# EAGLE design E-P-015-R1.1 (EAGLE 7.5.0)
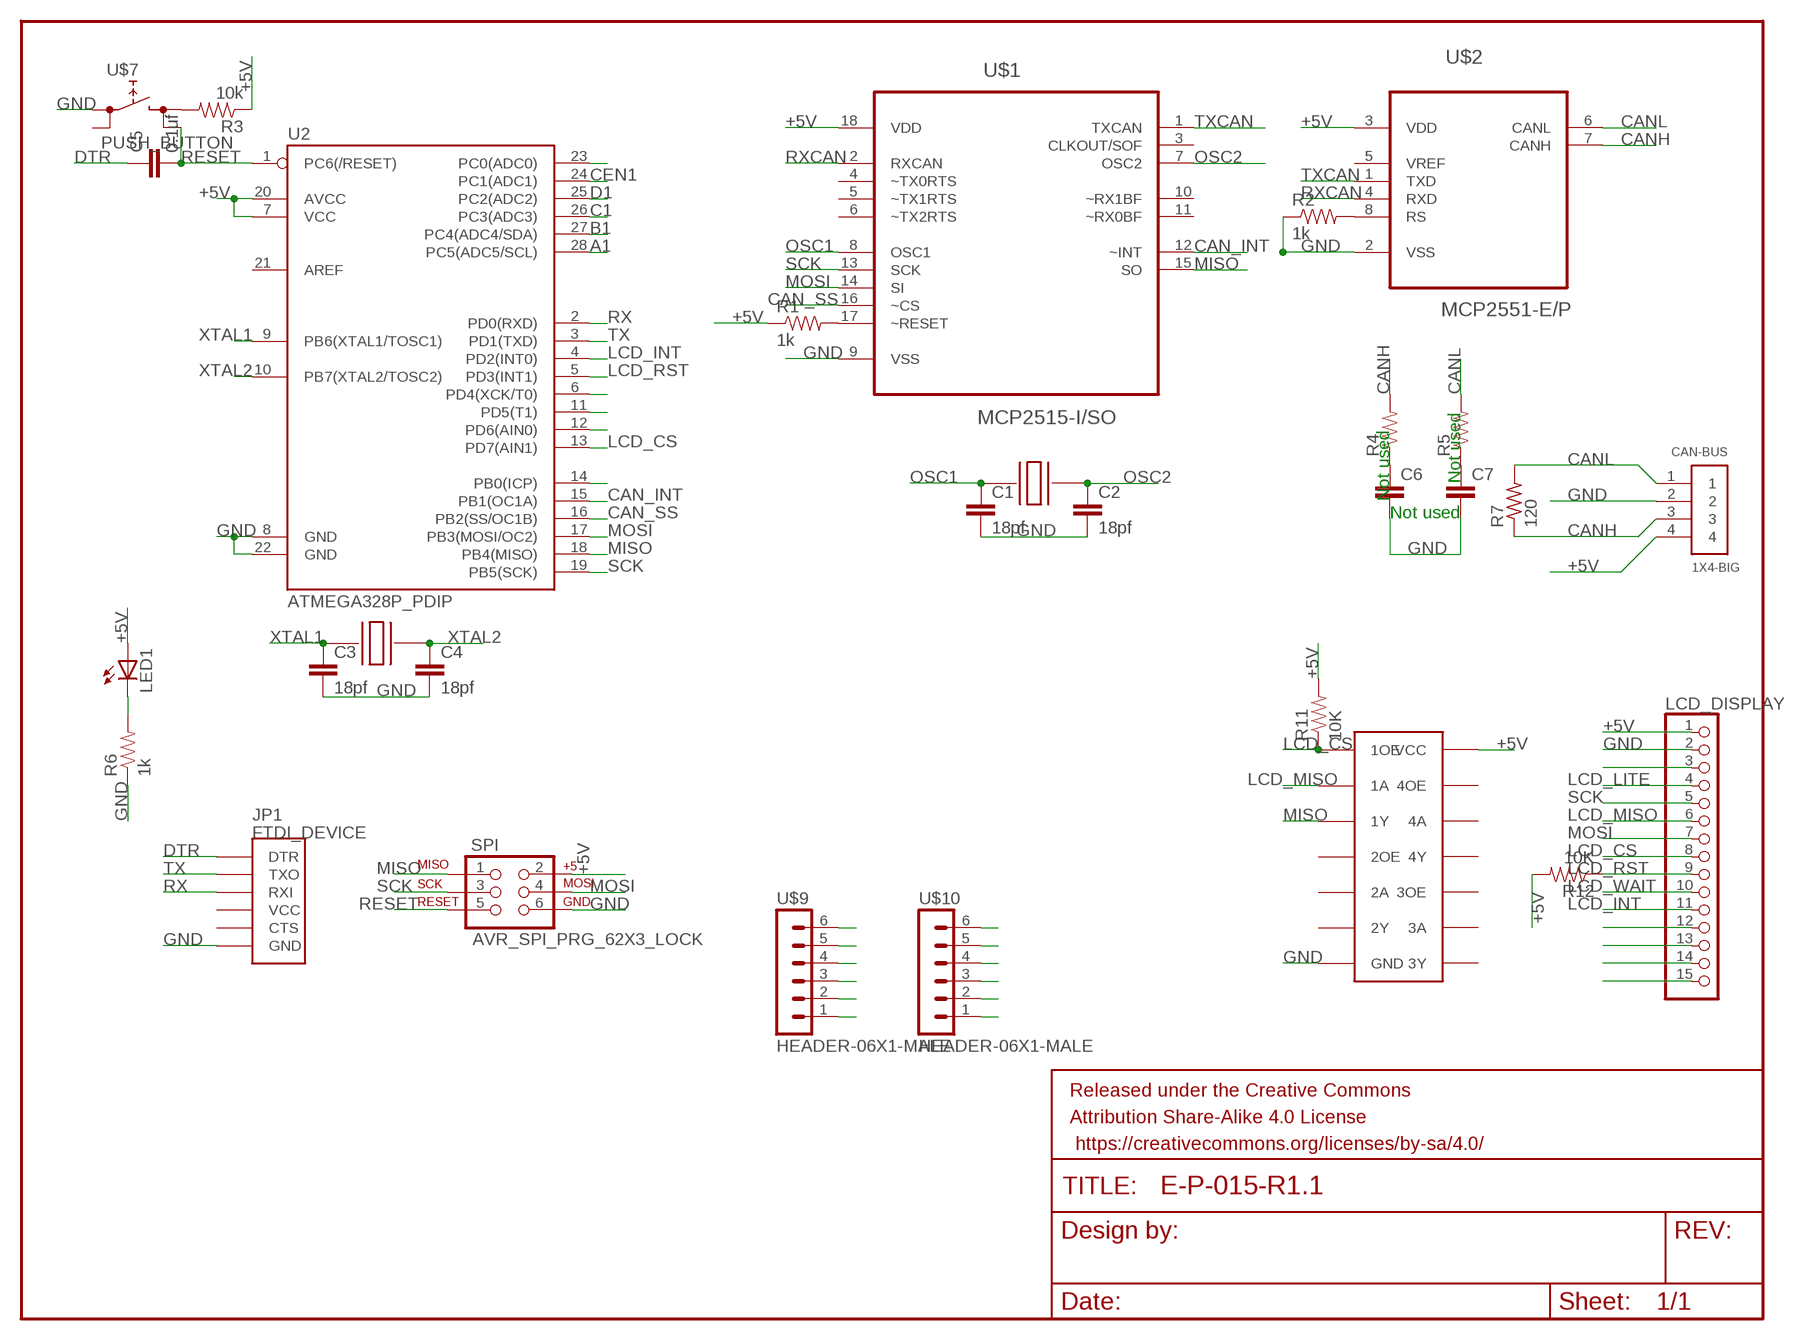
[diagram p0: schematic, sheet 1]

## Parts
C1  18pf  CAP0805  [0805]
C2  18pf  CAP0805  [0805]
C3  18pf  CAP0805  [0805]
C4  18pf  CAP0805  [0805]
C5  0.1uf  CAP0805  [0805]
C6  CAP0805  [0805]
C7  CAP0805  [0805]
CAN-BUS  1X4-BIG  [1X04-BIG]
FRAME1  FRAME-LETTERNO_PACKAGE  [DUMMY]
JP1  FTDI_DEVICE  [FTDI_DEVICE_SIDE]
LCD_DISPLAY  PINHD-1X15  [1X15]
LED1  LEDCHIPLED_1206  [CHIPLED_1206]
R1  1k  RESISTOR0805-RES  [0805]
R2  1k  RESISTOR0805-RES  [0805]
R3  10k  RESISTOR0805-RES  [0805]
R4  RESISTOR0805-RES  [0805]
R5  RESISTOR0805-RES  [0805]
R6  1k  RESISTOR0805-RES  [0805]
R7  120  R-US_M1206  [M1206]
R11  10K  RESISTOR0805-RES  [0805]
R12  10K  RESISTOR0805-RES  [0805]
SPI  AVR_SPI_PRG_62X3_LOCK  [2X3_LOCK]
U2  ATMEGA328P_PDIP  [DIL28-3]
U$1  MCP2515-I/SO  [SOIC127P1034X264-18N]
U$2  MCP2551-E/P  [DIP254P762X432-8]
U$3  CRYSTAL  [7A_CRYSTAL]
U$4  CRYSTAL  [7A_CRYSTAL]
U$5  SN74HC125N  [296-1572-5-ND]
U$7  PUSH_BUTTON  [PUSHBUTTON]
U$9  HEADER-06X1-MALE  [06X1-PTH]
U$10  HEADER-06X1-MALE  [06X1-PTH]

## Nets
+5V: CAN-BUS.4 LCD_DISPLAY.1 LED1.A R1.1 R3.1 R11.2 R12.2 SPI.2 U2.7(VCC) U2.20(AVCC) U$1.18(VDD) U$2.3(VDD) U$5.P$14(VCC)
A1: U2.28(PC5(ADC5/SCL)) U$9.6
A2: U2.23(PC0(ADC0)) U$10.6
B1: U2.27(PC4(ADC4/SDA)) U$9.5
B2: U2.6(PD4(XCK/T0)) U$10.5
C1: U2.26(PC3(ADC3)) U$9.4
C2: U2.11(PD5(T1)) U$10.4
CAN_INT: U2.15(PB1(OC1A)) U$1.12(~INT)
CAN_SS: U2.16(PB2(SS/OC1B)) U$1.16(~CS)
CANH: CAN-BUS.3 R4.2 R7.1 U$2.7(CANH)
CANL: CAN-BUS.1 R5.2 R7.2 U$2.6(CANL)
CEN1: U2.24(PC1(ADC1)) U$9.2
CEN2: U2.14(PB0(ICP)) U$10.2
D1: U2.25(PC2(ADC2)) U$9.3
D2: U2.12(PD6(AIN0)) U$10.3
DTR: C5.1 JP1.P$1(DTR)
GND: C1.2 C2.2 C3.2 C4.2 C6.2 C7.2 CAN-BUS.2 JP1.P$6(GND) LCD_DISPLAY.2 R2.1 R6.1 SPI.6 U2.8(GND) U2.22(GND) U$1.9(VSS) U$2.2(VSS) U$5.P$7(GND) U$7.L1(L) U$9.1 U$10.1
LCD_CS: LCD_DISPLAY.8 R11.1 U2.13(PD7(AIN1)) U$5.P$1(1OE)
LCD_INT: LCD_DISPLAY.11 U2.4(PD2(INT0))
LCD_LITE: LCD_DISPLAY.4
LCD_MISO: LCD_DISPLAY.6 U$5.P$2(1A)
LCD_RST: LCD_DISPLAY.9 R12.1 U2.5(PD3(INT1))
LCD_WAIT: LCD_DISPLAY.10
MISO: SPI.1 U2.18(PB4(MISO)) U$1.15(SO) U$5.P$3(1Y)
MOSI: LCD_DISPLAY.7 SPI.4 U2.17(PB3(MOSI/OC2)) U$1.14(SI)
N$1: R1.2 U$1.17(~RESET)
N$2: R2.2 U$2.8(RS)
N$3: C6.1 R4.1
N$4: R3.2 U$7.R1(R)
N$5: C7.1 R5.1
N$8: LED1.C R6.2
N$9: LCD_DISPLAY.3
N$20: LCD_DISPLAY.12
N$21: LCD_DISPLAY.13
N$22: LCD_DISPLAY.14
N$23: LCD_DISPLAY.15
OSC1: C1.1 U$1.8(OSC1) U$3.P$2
OSC2: C2.1 U$1.7(OSC2) U$3.P$1
RESET: C5.2 SPI.5 U2.1(PC6(/RESET)) U$7.R2(R)
RX: JP1.P$3(RXI) U2.2(PD0(RXD))
RXCAN: U$1.2(RXCAN) U$2.4(RXD)
SCK: LCD_DISPLAY.5 SPI.3 U2.19(PB5(SCK)) U$1.13(SCK)
TX: JP1.P$2(TXO) U2.3(PD1(TXD))
TXCAN: U$1.1(TXCAN) U$2.1(TXD)
XTAL1: C3.1 U2.9(PB6(XTAL1/TOSC1)) U$4.P$2
XTAL2: C4.1 U2.10(PB7(XTAL2/TOSC2)) U$4.P$1
Unconnected: JP1.P$4(VCC) JP1.P$5(CTS) U2.21(AREF) U$1.3(CLKOUT/SOF) U$1.4(~TX0RTS) U$1.5(~TX1RTS) U$1.6(~TX2RTS) U$1.10(~RX1BF) U$1.11(~RX0BF) U$2.5(VREF) U$5.P$4(2OE) U$5.P$5(2A) U$5.P$6(2Y) U$5.P$8(3Y) U$5.P$9(3A) U$5.P$10(3OE) U$5.P$11(4Y) U$5.P$12(4A) U$5.P$13(4OE) U$7.L2(L)

## Notes on the sheet
- Not used
- Not used
- Not used

## Library data of the parts
C1-C7 = SparkFun-Capacitors:CAP: Capacitor Standard 0603 ceramic capacitor, and 0.1" leaded capacitor.
CAN-BUS = adafruit:1X4: 4-pin connector
FRAME1 = SparkFun-Aesthetics:FRAME-LETTER: Schematic Frame Standard 8.5x11 US Letter frame; DESIGNER: Nobody; VERSION: v01
JP1 = SparkFun-Connectors:FTDI_DEVICE: Connector which mates to FTDI basic or FTDI cable.
LCD_DISPLAY = pinhead:PINHD-1X15: PIN HEADER
LED1 = E-P-099-R2.2:LED: LED OSRAM: - CHIPLED LG R971, LG N971, LY N971, LG Q971, LY Q971, LO R971, LY R971 LH N974, LH R974 LS Q976, LO Q976, LY Q976 LO Q996 - Hyper CHIPLED LW Q18S LB Q993, LB Q99A, LB R99A - SideLED LS A670, LO A670, LY A670, LG A670, LP A670 LB A673, LV A673, LT A673, LW A673 LH A674 LY A675 LS A676, LA A676, LO A676, LY A676, LW A676 LS A679, LY A679, LG A679 - Hyper Micro SIDELED® LS Y876, LA Y876, LO Y876, LY Y876 LT Y87S - SmartLED LW L88C, LW L88S LB L89C, LB L89S, LG L890 LS L89K, LO L89K, LY L89K LS L896, LA L896, LO L896, LY L896 - TOPLED LS T670, LO T670, LY T670, LG T670, LP T670 LSG T670, LSP T670, LSY T670, LOP T670, LYG T670 LG T671, LOG T671, LSG T671 LB T673, LV T673, LT T673, LW T673 LH T674 LS T676, LA T676, LO T676, LY T676, LB T676, LH T676, LSB T676, LW T676 LB T67C, LV T67C, LT T67C, LS T67K, LO T67K, LY T67K, LW E67C LS E67B, LA E67B, LO E67B, LY E67B, LB E67C, LV E67C, LT E67C LW T67C LS T679, LY T679, LG T679 LS T770, LO T770, LY T770, LG T770, LP T770 LB T773, LV T773, LT T773, LW T773 LH T774 LS E675, LA E675, LY E675, LS T675 LS T776, LA T776, LO T776, LY T776, LB T776 LHGB T686 LT T68C, LB T68C - Hyper Mini TOPLED® LB M676 - Mini TOPLED Santana® LG M470 LS M47K, LO M47K, LY M47K Source: http://www.osram.convergy.de LUXEON: - LUMILED® LXK2-PW12-R00, LXK2-PW12-S00, LXK2-PW14-U00, LXK2-PW14-V00 LXK2-PM12-R00, LXK2-PM12-S00, LXK2-PM14-U00 LXK2-PE12-Q00, LXK2-PE12-R00, LXK2-PE12-S00, LXK2-PE14-T00, LXK2-PE14-U00 LXK2-PB12-K00, LXK2-PB12-L00, LXK2-PB12-M00, LXK2-PB14-N00, LXK2-PB14-P00, LXK2-PB14-Q00 LXK2-PR12-L00, LXK2-PR12-M00, LXK2-PR14-Q00, LXK2-PR14-R00 LXK2-PD12-Q00, LXK2-PD12-R00, LXK2-PD12-S00 LXK2-PH12-R00, LXK2-PH12-S00 LXK2-PL12-P00, LXK2-PL12-Q00, LXK2-PL12-R00 Source: www.luxeon.com KINGBRIGHT: KA-3528ASYC Source: www.kingbright.com
R1-R6 = SparkFun-Passives:RESISTOR: Resistor Basic schematic elements and footprints for 0603, 1206, and PTH resistors.
R7 = adafruit:R-US_: RESISTOR, American symbol
R11 R12 = SparkFun-Resistors:RESISTOR: Resistor Basic schematic elements and footprints for 0603, 1206, and PTH resistors.
SPI = SparkFun-Connectors:AVR_SPI_PRG_6: AVR ISP 6 Pin This is the reduced ISP connector for AVR programming. Common on Arduino. This footprint will take up less PCB space and can be used with a 10-pin to 6-pin adapter such as SKU: BOB-08508 **Special note about "TEST_POINT" package. The stop mask is on the top side, so if you want your programming test points to be on the bottom of your board, make sure to place this package on the bottom side of the board. This also ensure that the orientation to program from the bottom side will be correct.
U2 = SparkFun-DigitalIC:ATMEGA328P_PDIP: uC used in the Arduino 32kb flash, 1k EEPROM, 2k SRAM This is the through-hole version of this chip.
U$1 = Microchip_By_element14_Batch_1:MCP2515-I/SO: CAN Controller; MPN: MCP2515-I/SO; OC_FARNELL: 1292239; OC_NEWARK: 29H7136; PACKAGE: SOIC-18; SUPPLIER: Microchip
U$2 = Microchip_By_element14_Batch_1:MCP2551-E/P: High-Speed CAN Transceiver; MPN: MCP2551-E/P; OC_FARNELL: 1439745; OC_NEWARK: 69K7603; PACKAGE: DIP-8; SUPPLIER: Microchip
U$3 U$4 = mylibrary:CRYSTAL
U$5 = Shell2015:SN74HC125N
U$7 = E-P-099-R2.2:PUSH_BUTTON
U$9 U$10 = GeekAmmo:HEADER-06X1?: 6 x 0.1 inch Header 40x1 0.1inch Male Breakaway header can be used. - 4UCON 00834 <http://www.4uconnector.com/online/SearchPro.asp?FormName=ProSearch&FormAction=search&s_GroupNo=&s_keyword=00834> For female part, if possible use 6 x 1 without breaking.; OTHER: 4UCON 00834; URL: http://www.4uconnector.com/online/SearchPro.asp?FormName=ProSearch&FormAction=search&s_GroupNo=&s_keyword=00834

## Board
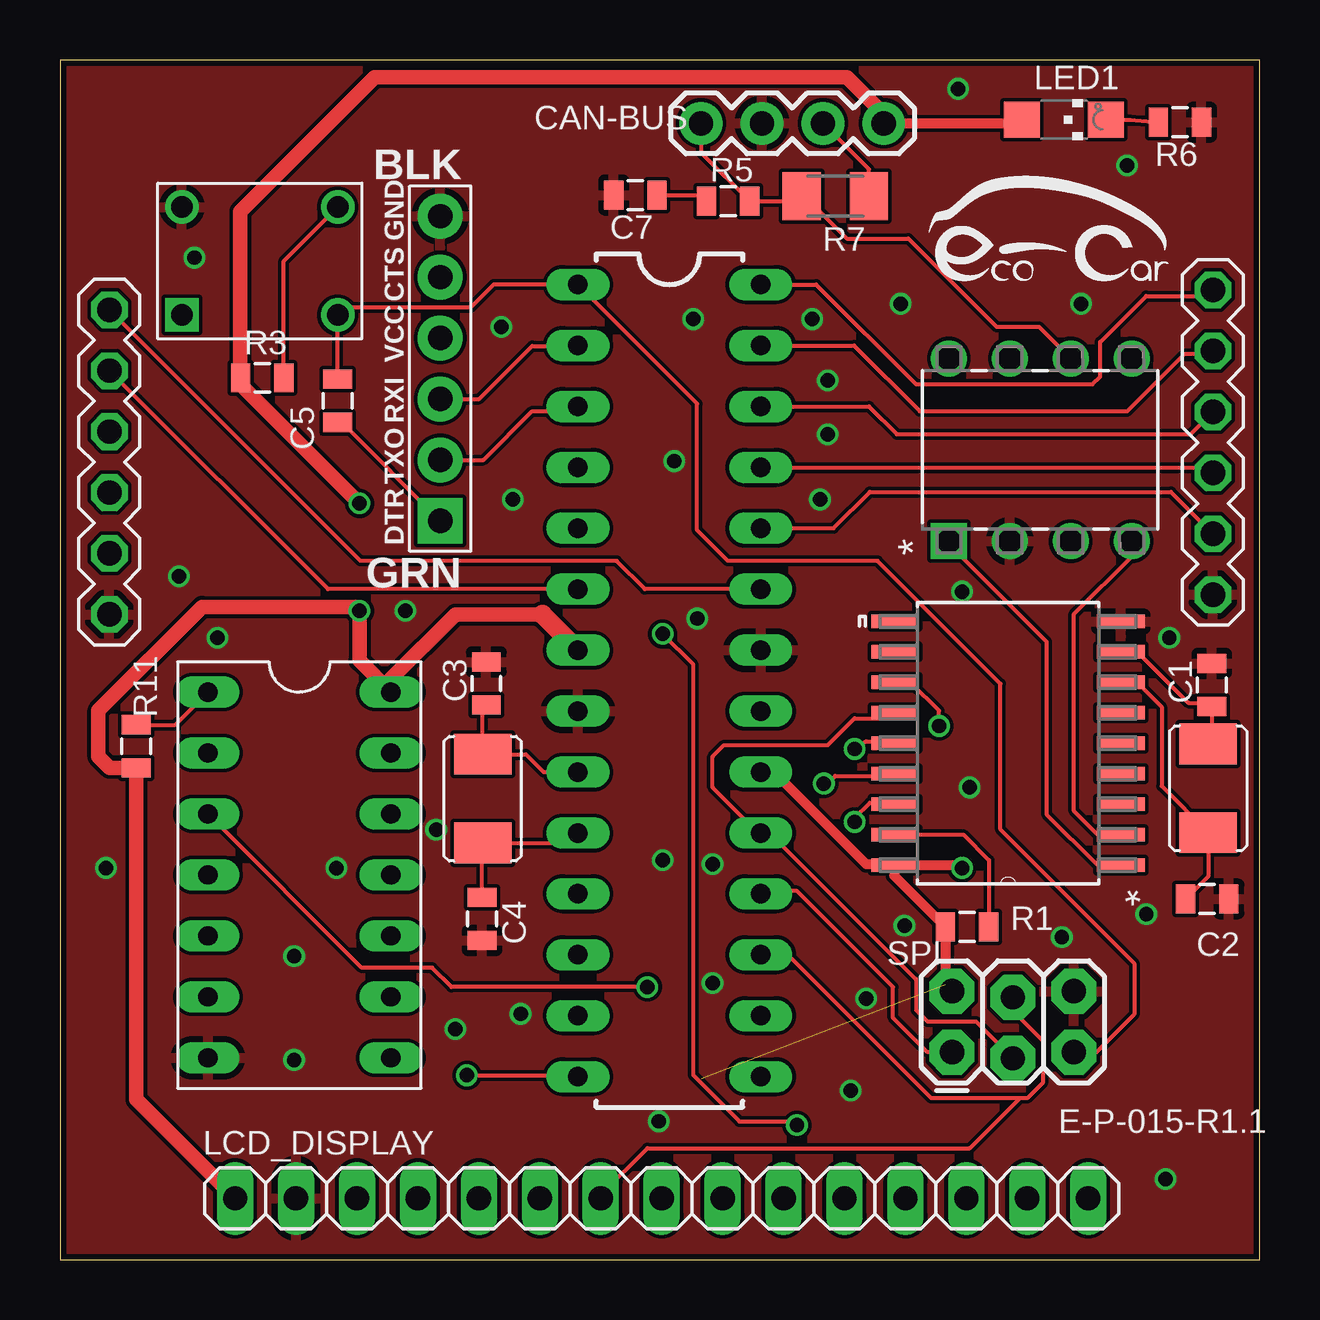
[diagram p1: board, top side]
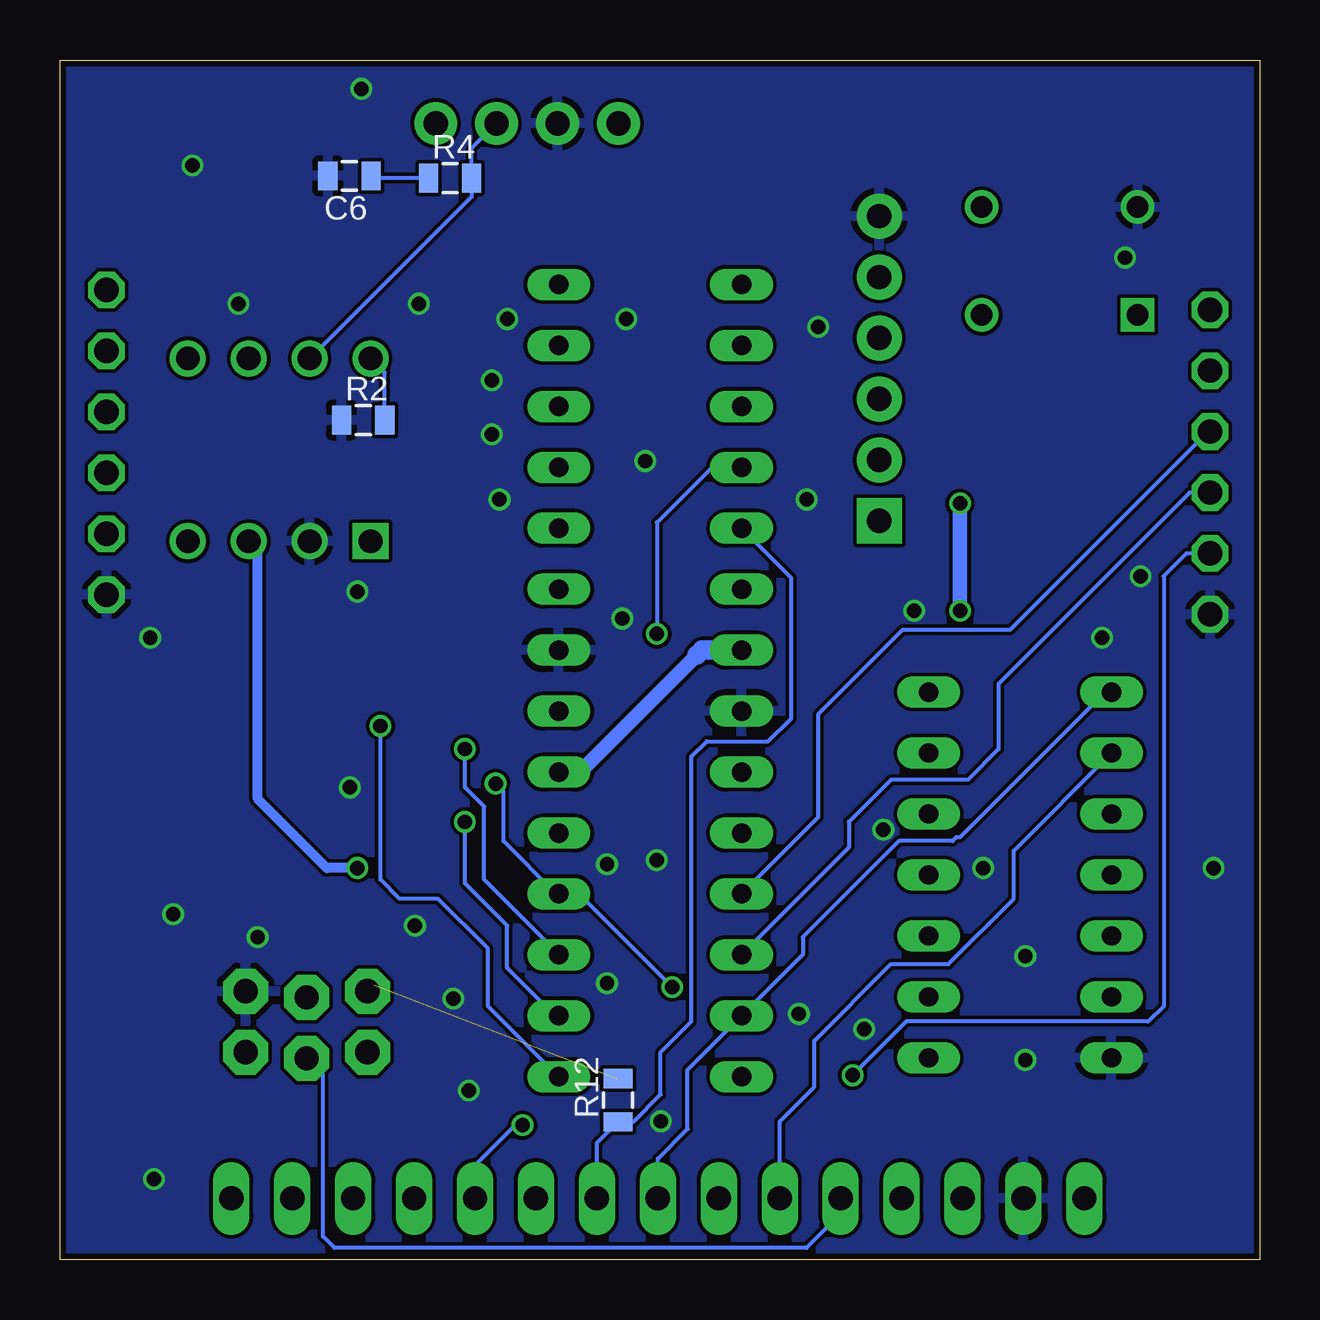
[diagram p2: board, bottom side, seen from below]

Size 50 x 50 mm. Coordinates in mm from the lower left corner, seen from the top.
Outline: 0,0 50,0 50,50 0,50 0,0
Copper layers (1*16): Top 0.035mm / dielectric 1.5mm / Bottom 0.035mm
Design rules "SeeedStudio_2layer_DRU_no_angle_20140221": minimum track width 6mil, minimum drill 12mil, track to track 6mil, track to pad 6mil, pad to pad 6mil, via to via 6mil, smd to smd 0mil, copper to edge 10mil, drill to drill 10mil, minimum pad ring 10mil, minimum via ring 6mil, stop-mask expansion 2mil, vias tented up to drill 100mil, thermal gap 10mil

### Footprints (pad centres in the part's own frame; a part is rotated, then mirrored left to right if it is on the bottom)
0805 = smd 0.8 x 1.2: 1 -0.9,0; 2 0.9,0
1X04-BIG = drill 1.016 pad 1.778: 1 0,0; 2 2.54,0; 3 5.08,0; 4 7.62,0
FTDI_DEVICE_SIDE = drill 1.016 pad 1.88 square: P$1 -6.35,0 | drill 1.016 pad 1.88: P$2 -3.81,0; P$3 -1.27,0; P$4 1.27,0; P$5 3.81,0; P$6 6.35,0
1X15 = drill 1.016 long: 1 -17.78,0; 2 -15.24,0; 3 -12.7,0; 4 -10.16,0; 5 -7.62,0; 6 -5.08,0; 7 -2.54,0; 8 0,0; 9 2.54,0; 10 5.08,0; 11 7.62,0; 12 10.16,0; 13 12.7,0; 14 15.24,0; 15 17.78,0
CHIPLED_1206 = smd 1.5 x 1.5: A 0,-1.75; C 0,1.75
M1206 = smd 1.6 x 2: 1 -1.4,0; 2 1.4,0
2X3_LOCK = drill 1.016 pad 1.88 octagon: 1 0,0; 2 0,2.54; 3 2.54,-0.254; 4 2.54,2.286; 5 5.08,0; 6 5.08,2.54
DIL28-3 = drill 0.813 long: 1 -16.51,-3.81; 2 -13.97,-3.81; 3 -11.43,-3.81; 4 -8.89,-3.81; 5 -6.35,-3.81; 6 -3.81,-3.81; 7 -1.27,-3.81; 8 1.27,-3.81; 9 3.81,-3.81; 10 6.35,-3.81; 11 8.89,-3.81; 12 11.43,-3.81; 13 13.97,-3.81; 14 16.51,-3.81; 15 16.51,3.81; 16 13.97,3.81; 17 11.43,3.81; 18 8.89,3.81; 19 6.35,3.81; 20 3.81,3.81; 21 1.27,3.81; 22 -1.27,3.81; 23 -3.81,3.81; 24 -6.35,3.81; 25 -8.89,3.81; 26 -11.43,3.81; 27 -13.97,3.81; 28 -16.51,3.81
SOIC127P1034X264-18N = smd 1.981 x 0.559: 1 -4.699,5.08; 2 -4.699,3.81; 3 -4.699,2.54; 4 -4.699,1.27; 5 -4.699,0; 6 -4.699,-1.27; 7 -4.699,-2.54; 8 -4.699,-3.81; 9 -4.699,-5.08; 10 4.699,-5.08; 11 4.699,-3.81; 12 4.699,-2.54; 13 4.699,-1.27; 14 4.699,0; 15 4.699,1.27; 16 4.699,2.54; 17 4.699,3.81; 18 4.699,5.08
DIP254P762X432-8 = drill 0.991 square: 1 -7.62,7.62 | drill 0.991: 2 -7.62,5.08; 3 -7.62,2.54; 4 -7.62,0; 5 0,0; 6 0,2.54; 7 0,5.08; 8 0,7.62
7A_CRYSTAL = smd 1.7 x 2.4: P$1 -1.85,0; P$2 1.85,0
296-1572-5-ND = drill 0.8 long: P$1 -3.81,10.16; P$2 -3.81,7.62; P$3 -3.81,5.08; P$4 -3.81,2.54; P$5 -3.81,0; P$6 -3.81,-2.54; P$7 -3.81,-5.08; P$8 3.81,-5.08; P$9 3.81,-2.54; P$10 3.81,0; P$11 3.81,2.54; P$12 3.81,5.08; P$13 3.81,7.62; P$14 3.81,10.16
PUSHBUTTON = drill 0.889: L1 0,4.5; R1 6.5,4.5; R2 6.5,0 | drill 0.889 square: L2 0,0
06X1-PTH = drill 1.016 octagon: 1 -6.35,0; 2 -3.81,0; 3 -1.27,0; 4 1.27,0; 5 3.81,0; 6 6.35,0

### Placement (x,y rotation side)
C1  48.01,23.95 90 top
C2  47.82,15.03 0 top
C3  17.77,24.01 90 top
C4  17.59,14.2 270 top
C5  11.57,35.8 90 top
C6  37.93,45.17 180 bottom
C7  23.98,44.37 180 top
CAN-BUS  26.72,47.36 0 top
FRAME1  -48.26,67.31 0 top  (outside the outline)
JP1  15.85,37.14 90 top
LCD_DISPLAY  25.08,2.55 0 top
LED1  41.85,47.51 270 top
R1  37.81,13.87 0 top
R2  37.36,34.99 0 bottom
R3  8.43,36.75 0 top
R4  33.74,45.07 0 bottom
R5  27.85,44.11 0 top
R6  46.68,47.41 180 top
R7  32.32,44.32 180 top
R11  3.18,21.39 270 top
R12  26.74,6.64 90 bottom
SPI  37.18,8.64 0 top
U2  25.4,24.13 270 top
U$1  39.52,21.52 180 top
U$2  44.67,37.56 90 top
U$3  47.86,19.64 90 top
U$4  17.62,19.21 90 top
U$5  9.98,13.49 0 top
U$7  5.08,39.37 0 top
U$9  48.06,34.06 90 top
U$10  2.06,33.24 90 top

### Tracks (layer width: path | path; a pad name or v marks a point on that pad's centre or on a via)
+5V  (via drill 0.6)  (1 unrouted)
  Top 0.16: 34.78,16.48 U$1.18 | 37.48,16.44 v37.6,16.32 | R3.1 7.52,36.48 | 12.32,27.2 v12.48,27.04 | 39.95,47.36 LED1.A
  Top 0.406: U2.20 29.76,20.32 33.6,16.48 34.78,16.48 34.78,16 R1.1 36.91,11.45 SPI.2 | U$1.18 37.48,16.44 | CAN-BUS.4 39.95,47.36 | U$5.P$14 13.79,24.19
  Top 0.61: CAN-BUS.4 34.34,47.74 32.8,49.28 13.12,49.28 7.52,43.68 R3.1 | 7.52,36.48 v12.48,31.52 | v12.48,27.04 12.48,24.96 U$5.P$14 | 12.32,27.2 5.92,27.2 1.6,22.88 1.6,20.96 2.07,20.49 R11.2 3.18,6.67 LCD_DISPLAY.1 | 13.79,24.19 16.48,26.88 20.11,26.88
  Top 0.813: 20.11,26.88 U2.7
  Bottom 0.406: v37.6,16.32 38.88,16.32 41.76,19.2 41.76,29.57 U$2.3
  Bottom 0.61: v12.48,31.52 v12.48,27.04 | 23.44,25.2 28.32,20.32 U2.20
  Bottom 0.813: U2.7 23.24,25.4 23.44,25.2
A1
  Top 0.16: U2.28 31.52,40.64 35.68,36.48 43.04,36.48 43.36,36.8 43.36,38.24 45.28,40.16 47.81,40.16 U$9.6
A2
  Top 0.16: U2.23 24.38,27.94 23.2,29.12 12.53,29.12 U$10.6
B1
  Top 0.16: U2.27 33.1,38.1 35.84,35.36 44.48,35.36 46.88,37.76 47.95,37.76 U$9.5
B2
  Top 0.16: U2.6 11.17,27.94 U$10.5
C1
  Top 0.16: U2.26 33.72,35.56 34.88,34.4 47.13,34.4 U$9.4
C2
  Bottom 0.16: U$10.4 2.13,34.51 10.4,26.24 14.88,26.24 18.4,22.72 18.4,18.43 U2.11
CAN_INT  (via drill 0.6)
  Top 0.16: v36.64,22.24 36.64,22.88 35.52,24 34.88,24 U$1.12
  Bottom 0.16: U2.15 32.16,10.56 32.16,12.96 34.24,15.04 35.84,15.04 36.64,15.84 v36.64,22.24
CAN_SS  (via drill 0.6)
  Top 0.16: v33.12,18.24 33.12,18.4 33.76,19.04 34.76,19.04 U$1.16
  Bottom 0.16: U2.16 29.36,10.16 31.36,12.16 31.36,13.92 33.12,15.68 v33.12,18.24
CANH
  Top 0.16: R7.1 33.72,45.44 CAN-BUS.3
  Bottom 0.16: CAN-BUS.3 32.84,46.32 R4.2 32.84,44.31 U$2.7
CANL
  Top 0.16: CAN-BUS.1 26.72,46.14 R5.2 30.71,44.11 R7.2 31.04,44.32 32.8,42.56 35.36,42.56 39.04,38.88 40.81,38.88 U$2.6
CEN1
  Top 0.16: U2.24 32.24,30.48 33.76,32 46.31,32 U$9.2
CEN2  (via drill 0.6)
  Top 0.16: v16.96,7.68 21.53,7.68 U2.14
  Bottom 0.16: U$10.2 3.05,29.43 4,28.48 4,10.56 4.64,9.92 14.72,9.92 v16.96,7.68
D1
  Top 0.16: U2.25 47.83,33.02 U$9.3
D2
  Bottom 0.16: U$10.3 2.91,31.97 10.88,24 10.88,21.28 12.16,20 15.36,20 17.12,18.24 17.12,17.17 U2.12
DTR
  Top 0.16: C5.1 11.74,34.9 JP1.P$1
GND  (via drill 0.6)
  other vias: 25.6,33.28 18.4,38.88 26.4,39.2 27.2,16.48 27.2,11.52 14.4,27.04 32.96,7.04 33.6,10.88 35.2,13.92 6.56,25.92 4.96,28.48 5.6,41.76 1.92,16.32 11.52,16.32 9.76,12.64 9.76,8.32 19.2,10.24 16.48,9.6 25.12,16.64 24.96,5.76 15.68,17.92 46.08,3.36 41.76,13.44 37.92,19.68 37.6,27.84 46.24,25.92 45.28,14.4 26.56,26.72 18.88,31.68 42.56,39.84 35.04,39.84 32,36.64 32,34.4 31.68,31.68 31.36,39.2 37.44,48.8 44.48,45.6
  pour Bottom: -16,57.76 61.6,57.76 61.6,-0.64 -16.32,-0.64 -16,57.44 -16,57.6
  pour Top: 56.8,56.64 56.8,-0.48 -12.48,-0.48 -12.48,56.64
LCD_CS
  Top 0.16: R11.1 4.81,22.29 U$5.P$1
  Bottom 0.16: LCD_DISPLAY.8 25.08,4.2 23.84,5.44 23.84,7.91 U2.13 19.04,12.71 19.04,13.44 15.04,17.44 12.8,17.44 12.64,17.6 12.48,17.6 6.43,23.65 U$5.P$1
LCD_INT  (via drill 0.6)
  Top 0.16: v30.72,5.6 30.56,5.76 28.32,5.76 26.4,7.68 26.4,24.8 v25.12,26.08
  Bottom 0.16: U2.4 22.82,33.02 25.12,30.72 v25.12,26.08 | v30.72,5.6 31.04,5.6 32.64,4 32.64,2.61 LCD_DISPLAY.11
LCD_MISO
  Bottom 0.16: U$5.P$2 10.24,17.04 10.24,15.04 12.96,12.32 15.36,12.32 18.56,9.12 18.56,7.2 20,5.76 LCD_DISPLAY.6
LCD_RST
  Bottom 0.16: LCD_DISPLAY.9 27.62,4.86 R12.1 26.1,5.74 24.96,6.88 24.96,8.64 23.68,9.92 23.68,20.96 23.04,21.6 20.48,21.6 19.52,22.56 19.52,28.41 U2.5
MISO  (via drill 0.6)
  Top 0.16: v31.84,19.84 32,19.84 32.32,20.16 34.73,20.16 U$1.15 | SPI.1 36.16,8.64 34.72,10.08 34.72,11.36 30.72,15.36 29.92,15.36 29.68,15.6 29.57,15.6 U2.18 | v24.48,11.36 16.32,11.36 15.52,12.16 12.58,12.16 U$5.P$3
  Bottom 0.16: v31.84,19.84 31.52,19.52 31.52,17.44 29.32,15.24 U2.18 28.36,15.24 v24.48,11.36
MOSI  (via drill 0.6)
  Top 0.16: v33.12,21.28 33.6,21.6 34.74,21.6 U$1.14 | SPI.4 39.72,10.36 40.96,9.12 40.96,7.36 40.32,6.72 40,6.72 | 40,6.72 36.32,6.72 30.4,12.64 29.27,12.64 U2.17 | LCD_DISPLAY.7 22.54,2.7 24.48,4.64 37.92,4.64 40,6.72
  Bottom 0.16: U2.17 29.21,12.73 32.32,15.84 32.32,18.88 33.12,19.68 v33.12,21.28
N$1
  Top 0.16: U$1.17 37.65,17.71 38.72,16.64 R1.2
N$2
  Bottom 0.16: R2.2 36.46,36.97 U$2.8
N$3
  Bottom 0.16: R4.1 36.93,45.07 C6.1
N$4
  Top 0.16: R3.2 9.33,41.62 U$7.R1
N$5
  Top 0.16: C7.1 26.69,44.37 R5.1
N$8
  Top 0.16: LED1.C 44.6,47.51 R6.2
OSC1
  Top 0.16: U$1.8 44.91,25.33 47.04,23.2 47.86,23.2 C1.1 48.01,21.64 U$3.P$2
OSC2
  Top 0.16: U$1.7 44.9,24.06 45.92,23.04 45.92,19.73 U$3.P$1 47.86,15.97 C2.1
RESET
  Top 0.16: SPI.5 43.2,8.64 44.8,10.24 44.8,12.32 39.2,17.92 39.2,24 34.08,29.12 27.84,29.12 26.56,30.4 26.56,35.67 U2.1 18.08,40.64 17.12,39.68 11.89,39.68 U$7.R2 C5.2
RX
  Top 0.16: JP1.P$3 17.47,35.87 19.68,38.08 21.57,38.08 U2.2
RXCAN
  Top 0.16: U$2.4 44.67,29.31 42.24,26.88 42.24,18.72 43.2,17.76 44.17,17.76 U$1.2
SCK
  Top 0.16: U$1.13 34.59,22.56 33.12,22.56 32,21.44 27.68,21.44 27.2,20.96 27.2,19.68 29.1,17.78 U2.19 29.58,17.78 35.68,11.68 35.68,10.4 36.16,9.92 38.19,9.92 SPI.3
  Bottom 0.16: LCD_DISPLAY.5 17.46,1.9 18.88,0.48 38.56,0.48 39.04,0.96 39.04,7.71 SPI.3
TX
  Top 0.16: JP1.P$2 17.65,33.33 19.68,35.36 21.39,35.36 U2.3
TXCAN
  Top 0.16: U$2.1 37.05,29.83 41.12,25.76 41.12,18.56 43.2,16.48 44.18,16.48 U$1.1
XTAL1
  Top 0.16: U2.9 20.16,20.32 19.42,21.06 U$4.P$2 17.62,22.96 C3.1
XTAL2
  Top 0.16: U2.10 21.17,17.36 U$4.P$1 17.59,17.33 C4.1

### Text on the board
tPlace: E-P-015-R1.1